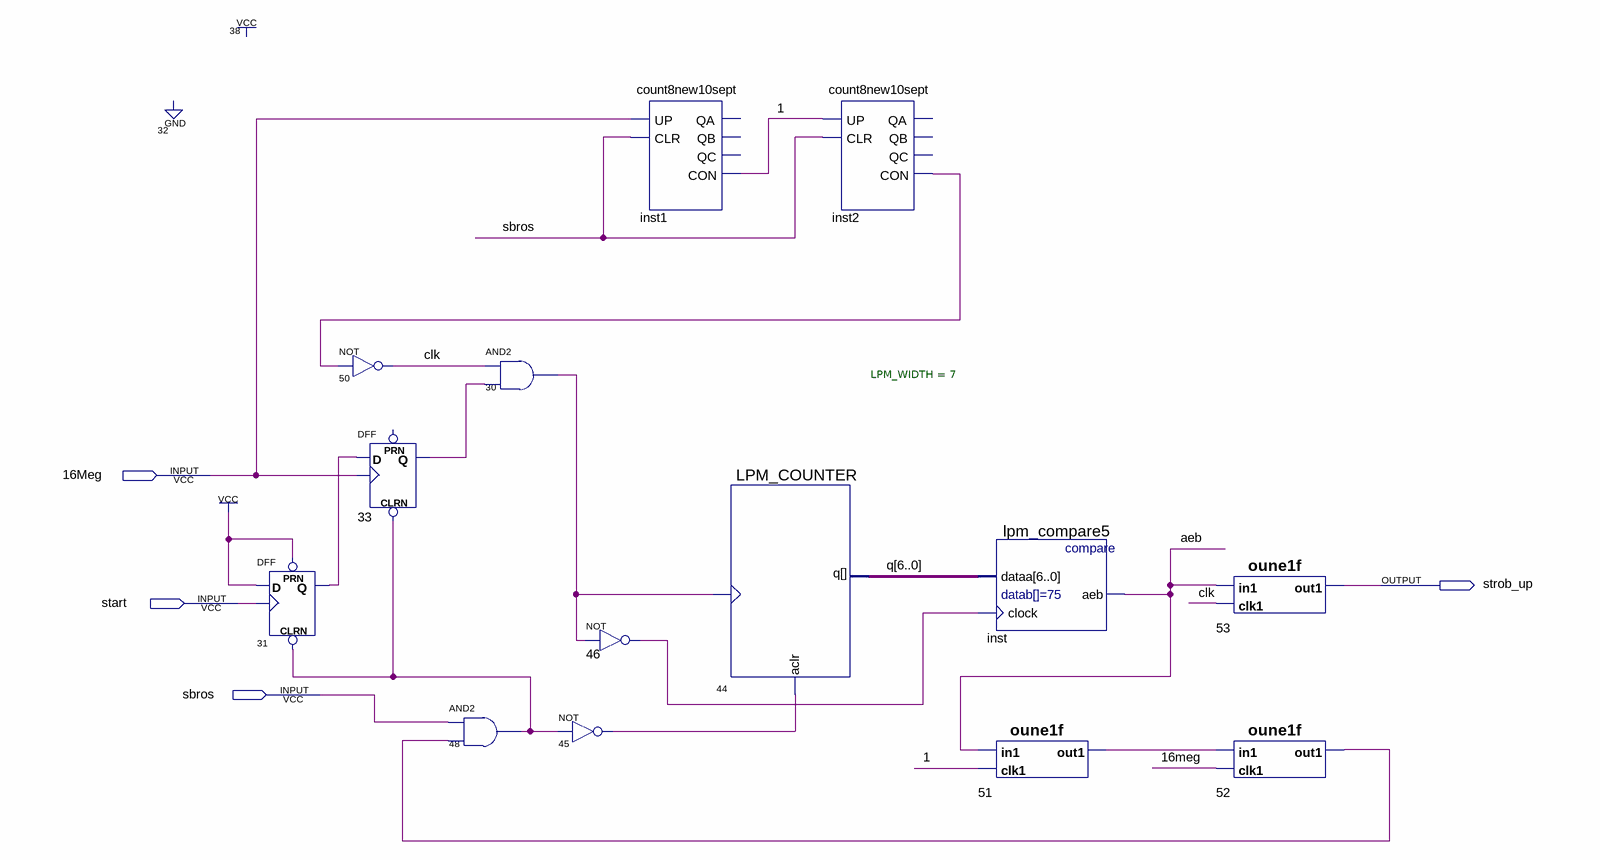
[diagram p0: schematic sheet]
// Quartus schematic strob3feb.bdf as structural Verilog: 14 symbols, 4 pins
module strob3feb (
  input  \16Meg ,
  input  start,
  input  sbros,
  output strob_up
);

  wire \1 , aeb, clk, inst2_con, n30_out, n31_q, n33_q, n45_out, n46_out, n48_out, n51_out1, n52_out1;
  wire [6:0] q;

  DFF u_31 (.CLRN(n48_out), .CLK(start), .D(1'b1), .PRN(1'b1), .Q(n31_q));
  not u_50 (clk, inst2_con);
  DFF u_33 (.CLRN(n48_out), .CLK(\16Meg ), .D(n31_q), .Q(n33_q));  // open: PRN
  and u_30 (n30_out, clk, n33_q);
  and u_48 (n48_out, sbros, n52_out1);
  not u_46 (n46_out, n30_out);
  not u_45 (n45_out, n48_out);
  count8new10sept inst1 (.UP(\16Meg ), .CLR(sbros), .CON(\1 ));  // open: QA, QB, QC
  LPM_COUNTER #(.LPM_WIDTH(7)) u_44 (.clock(n30_out), .aclr(n45_out), .q(q));
  count8new10sept inst2 (.UP(\1 ), .CLR(sbros), .CON(inst2_con));  // open: QA, QB, QC
  lpm_compare5 inst (.dataa(q), .clock(n46_out), .aeb(aeb));
  oune1f u_51 (.in1(aeb), .clk1(\1 ), .out1(n51_out1));
  oune1f u_53 (.in1(aeb), .clk1(clk), .out1(strob_up));
  oune1f u_52 (.in1(n51_out1), .clk1(\16Meg ), .out1(n52_out1));
endmodule
